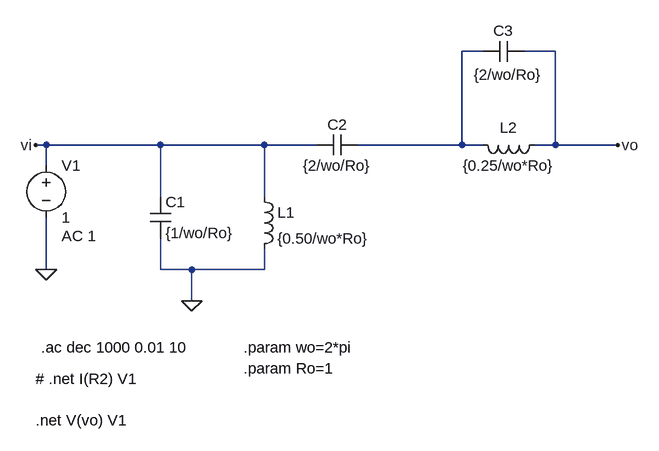
[diagram p0: schematic ej1aCuadripolos.asc]
ej1aCuadripolos.asc, the LTspice schematic file:
Version 4.1
SHEET 1 880 680
WIRE 400 -64 368 -64
WIRE 512 -64 464 -64
WIRE -272 80 -288 80
WIRE -96 80 -272 80
WIRE 64 80 -96 80
WIRE 144 80 64 80
WIRE 368 80 368 -64
WIRE 368 80 208 80
WIRE 400 80 368 80
WIRE 512 80 512 -64
WIRE 512 80 480 80
WIRE 608 80 512 80
WIRE -272 112 -272 80
WIRE -96 160 -96 80
WIRE 64 160 64 80
WIRE -272 272 -272 192
WIRE -96 272 -96 224
WIRE -48 272 -96 272
WIRE 64 272 64 240
WIRE 64 272 -48 272
WIRE -48 320 -48 272
FLAG -288 80 vi
FLAG -48 320 0
FLAG 608 80 vo
FLAG -272 272 0
SYMBOL cap -112 160 R0
SYMATTR InstName C1
SYMATTR Value {1/wo/Ro}
SYMBOL cap 208 64 R90
WINDOW 0 0 32 VBottom 2
WINDOW 3 32 32 VTop 2
SYMATTR InstName C2
SYMATTR Value {2/wo/Ro}
SYMBOL cap 464 -80 R90
WINDOW 0 0 32 VBottom 2
WINDOW 3 36 25 VTop 2
SYMATTR InstName C3
SYMATTR Value {2/wo/Ro}
SYMBOL ind 48 144 R0
SYMATTR InstName L1
SYMATTR Value {0.50/wo*Ro}
SYMATTR SpiceLine Rser=1m
SYMBOL ind 496 64 R90
WINDOW 0 5 56 VBottom 2
WINDOW 3 32 56 VTop 2
SYMATTR InstName L2
SYMATTR Value {0.25/wo*Ro}
SYMATTR SpiceLine Rser=1m
SYMBOL voltage -272 96 R0
WINDOW 123 24 124 Left 2
WINDOW 39 0 0 Left 0
SYMATTR Value2 AC 1
SYMATTR InstName V1
SYMATTR Value 1
TEXT -280 392 Left 2 !.ac dec 1000 0.01 10
TEXT -288 440 Left 2 !# .net I(R2) V1
TEXT -288 504 Left 2 !.net V(vo) V1
TEXT 32 392 Left 2 !.param wo=2*pi
TEXT 32 424 Left 2 !.param Ro=1

The netlist it stands for:
* ej1aCuadripolos.asc
C1 vi 0 {1/wo/Ro}
C2 N001 vi {2/wo/Ro}
C3 vo N001 {2/wo/Ro}
L1 vi 0 {0.50/wo*Ro} Rser=1m
L2 vo N001 {0.25/wo*Ro} Rser=1m
V1 vi 0 1 AC 1
.ac dec 1000 0.01 10
# .net I(R2) V1
.net V(vo) V1
.param wo=2*pi
.param Ro=1
.backanno
.end